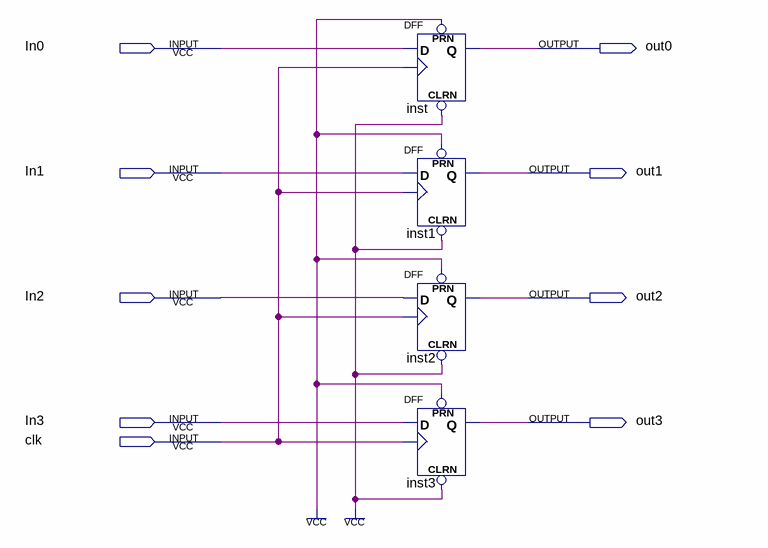
[diagram p0: schematic sheet]
// Quartus schematic register4bits.bdf as structural Verilog: 4 symbols, 9 pins
module register4bits (
  input  In0,
  input  In1,
  input  In2,
  input  In3,
  input  clk,
  output out0,
  output out1,
  output out2,
  output out3
);

  DFF inst (.CLRN(1'b1), .CLK(clk), .D(In0), .PRN(1'b1), .Q(out0));
  DFF inst1 (.CLRN(1'b1), .CLK(clk), .D(In1), .PRN(1'b1), .Q(out1));
  DFF inst2 (.CLRN(1'b1), .CLK(clk), .D(In2), .PRN(1'b1), .Q(out2));
  DFF inst3 (.CLRN(1'b1), .CLK(clk), .D(In3), .PRN(1'b1), .Q(out3));
endmodule
